# EAGLE design MeArm-v3 (EAGLE 9.5.2)
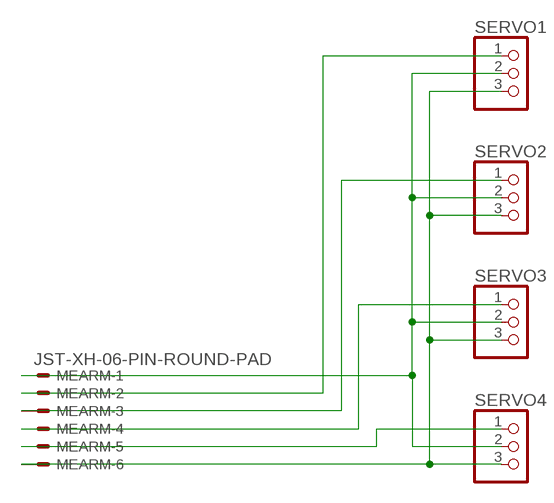
[diagram p0: schematic, sheet 1]

## Parts
MEARM  JST-XH-06-PIN-ROUND-PAD  [JST-XH-06-PACKAGE-ROUND-PAD]
SERVO1  PINHD-1X3  [1X03]
SERVO2  PINHD-1X3  [1X03]
SERVO3  PINHD-1X3  [1X03]
SERVO4  PINHD-1X3  [1X03]

## Nets
N$1: MEARM.1 SERVO1.2 SERVO2.2 SERVO3.2 SERVO4.2
N$2: MEARM.5 SERVO4.1
N$3: MEARM.4 SERVO3.1
N$6: MEARM.2 SERVO1.1
N$7: MEARM.3 SERVO2.1
N$8: MEARM.6 SERVO1.3 SERVO2.3 SERVO3.3 SERVO4.3

## Library data of the parts
MEARM = Rembrandt Electronics - JST XH Connectors v1-0:JST-XH-06-PIN: JST XH Connector 2 Pin Wire to board connector. Pitch: 2,54 mm, (0.100") Number of pins: 6 Created by Rembrandt Electronics www.rembrandtelectronics.com
SERVO1-SERVO4 = pinhead:PINHD-1X3: PIN HEADER

## Board
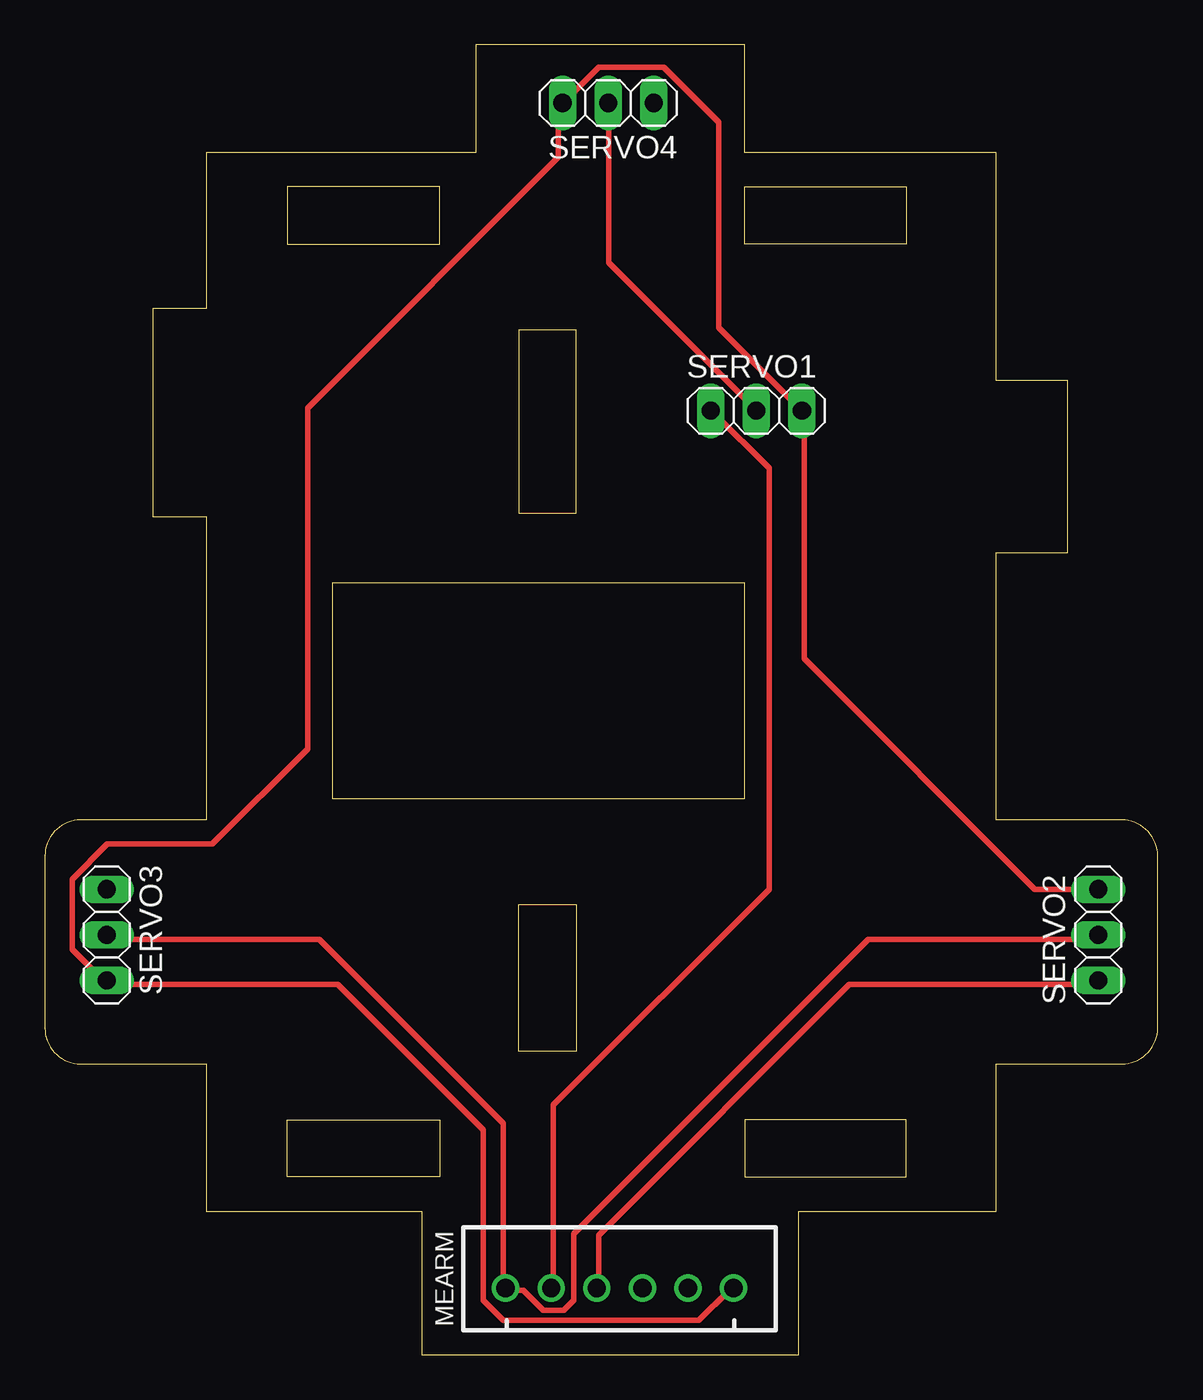
[diagram p1: board, top side]
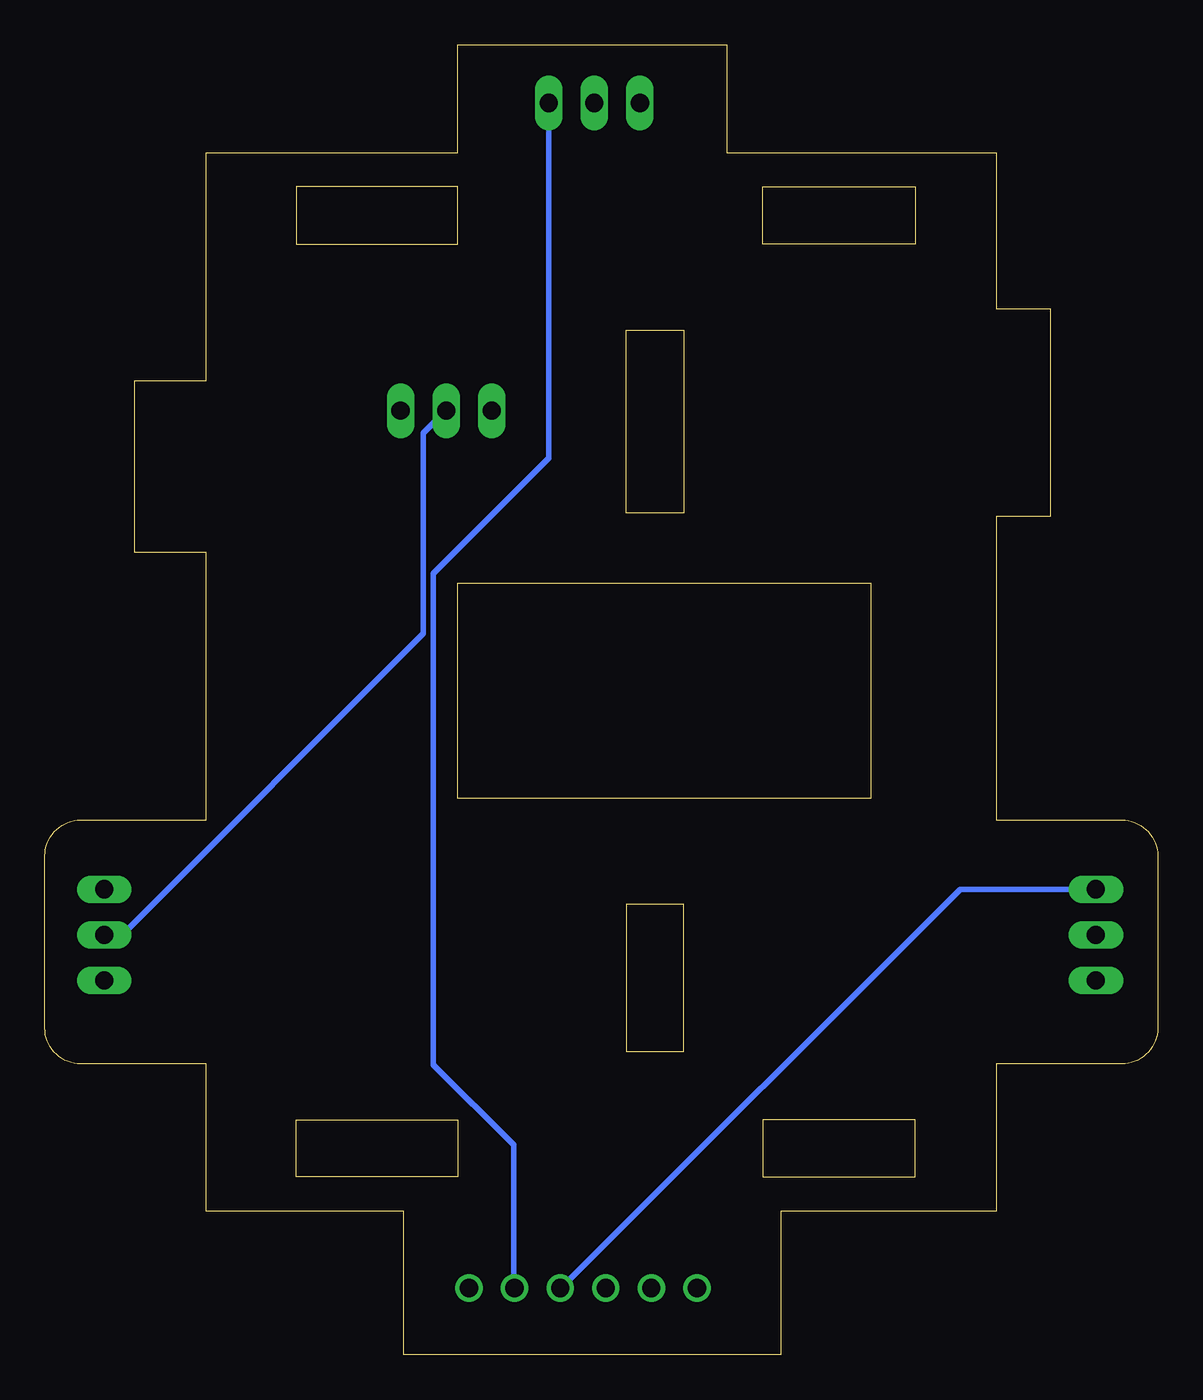
[diagram p2: board, bottom side, seen from below]

Size 62 x 73 mm. Coordinates in mm from the lower left corner, seen from the top.
Outline: 9,16.2 9,8 21,8 21,0 42,0 42,8 53,8 53,16.2 60,16.2 arc90 62,18.2 62,27.8 arc90 60,29.8 53,29.8 53,44.7 57,44.7 57,54.3 53,54.3 53,67 39,67 39,73 24,73 24,67 9,67 9,58.3 6,58.3 6,46.7 9,46.7 9,29.8 2,29.8 arc90 0,27.8 0,18.2 arc90 2,16.2 9,16.2
Outline: 22,9.9 13.5,9.9 13.5,13.1 22,13.1 22,9.9
Outline: 39,9.9 48,9.9 48,13.1 39,13.1 39,9.9
Outline: 39,65.1 48,65.1 48,61.9 39,61.9 39,65.1
Outline: 22,65.1 13.5,65.1 13.5,61.9 22,61.9 22,65.1
Outline: 29.6,16.9 26.4,16.9 26.4,25.1 29.6,25.1 29.6,16.9
Outline: 26.4,46.9 29.6,46.9 29.6,57.1 26.4,57.1 26.4,46.9
Outline: 39,43 16,43 16,31 39,31 39,43
Copper layers (1*16): Top 0.035mm / dielectric 1.5mm / Bottom 0.035mm
Design rules "default *": minimum track width 12mil, minimum drill 0.35mm, track to track 10mil, track to pad 10mil, pad to pad 6mil, via to via 6mil, smd to smd 6mil, copper to edge 40mil, drill to drill 6mil, minimum pad ring 10mil, minimum via ring 8mil, stop-mask expansion 4mil, vias tented up to drill 0mil, thermal gap 10mil

### Footprints (pad centres in the part's own frame; a part is rotated, then mirrored left to right if it is on the bottom)
JST-XH-06-PACKAGE-ROUND-PAD = drill 1.016: 1 -6.35,0; 2 -3.81,0; 3 -1.27,0; 4 1.27,0; 5 3.81,0; 6 6.35,0
1X03 = drill 1.016 long: 1 -2.54,0; 2 0,0; 3 2.54,0

### Placement (x,y rotation side)
MEARM  32.02,3.71 0 top
SERVO1  39.64,52.61 0 top
SERVO2  58.69,23.4 90 top
SERVO3  3.45,23.4 270 top
SERVO4  31.38,69.75 180 top

### Tracks (layer width: path | path; a pad name or v marks a point on that pad's centre or on a via)
N$1
  Top 0.305: SERVO3.2 3.47,23.15 15.28,23.15 25.54,12.88 25.54,3.87 MEARM.1 25.82,3.59 26.66,3.59 27.78,2.47 28.9,2.47 29.45,3.03 29.45,6.74 45.86,23.15 58.51,23.15 SERVO2.2 | SERVO4.2 31.41,69.53 31.41,60.87 39.51,52.76 SERVO1.2
  Bottom 0.305: SERVO2.2 58.51,23.43 57.67,23.43 40.91,40.19 40.91,51.37 39.79,52.48 SERVO1.2
N$2
  Bottom 0.305: SERVO4.1 33.92,49.97 40.35,43.54 40.35,16.16 35.88,11.69 35.88,3.87 MEARM.5
N$3
  Bottom 0.305: SERVO3.1 11.01,25.94 33.09,3.87 MEARM.4
N$6
  Top 0.305: MEARM.2 28.34,3.87 28.34,13.93 40.35,25.94 40.35,49.41 37.28,52.48 SERVO1.1
N$7
  Top 0.305: MEARM.3 30.85,3.87 30.85,6.66 44.82,20.63 58.51,20.63 SERVO2.1
N$8
  Top 0.305: MEARM.6 38.12,3.59 36.44,1.91 25.54,1.91 24.43,3.03 24.43,12.53 16.32,20.63 3.47,20.63 SERVO3.3 3.19,20.91 1.52,22.59 1.52,26.5 3.47,28.45 9.34,28.45 14.65,33.76 14.65,52.76 28.62,66.73 28.62,69.53 SERVO4.3 30.85,71.76 34.48,71.76 37.56,68.69 37.56,57.23 SERVO1.3 42.31,52.48 42.31,38.79 55.16,25.94 SERVO2.3